# Altium project NC1-1AA.PrjPcb (part 2 of 2)
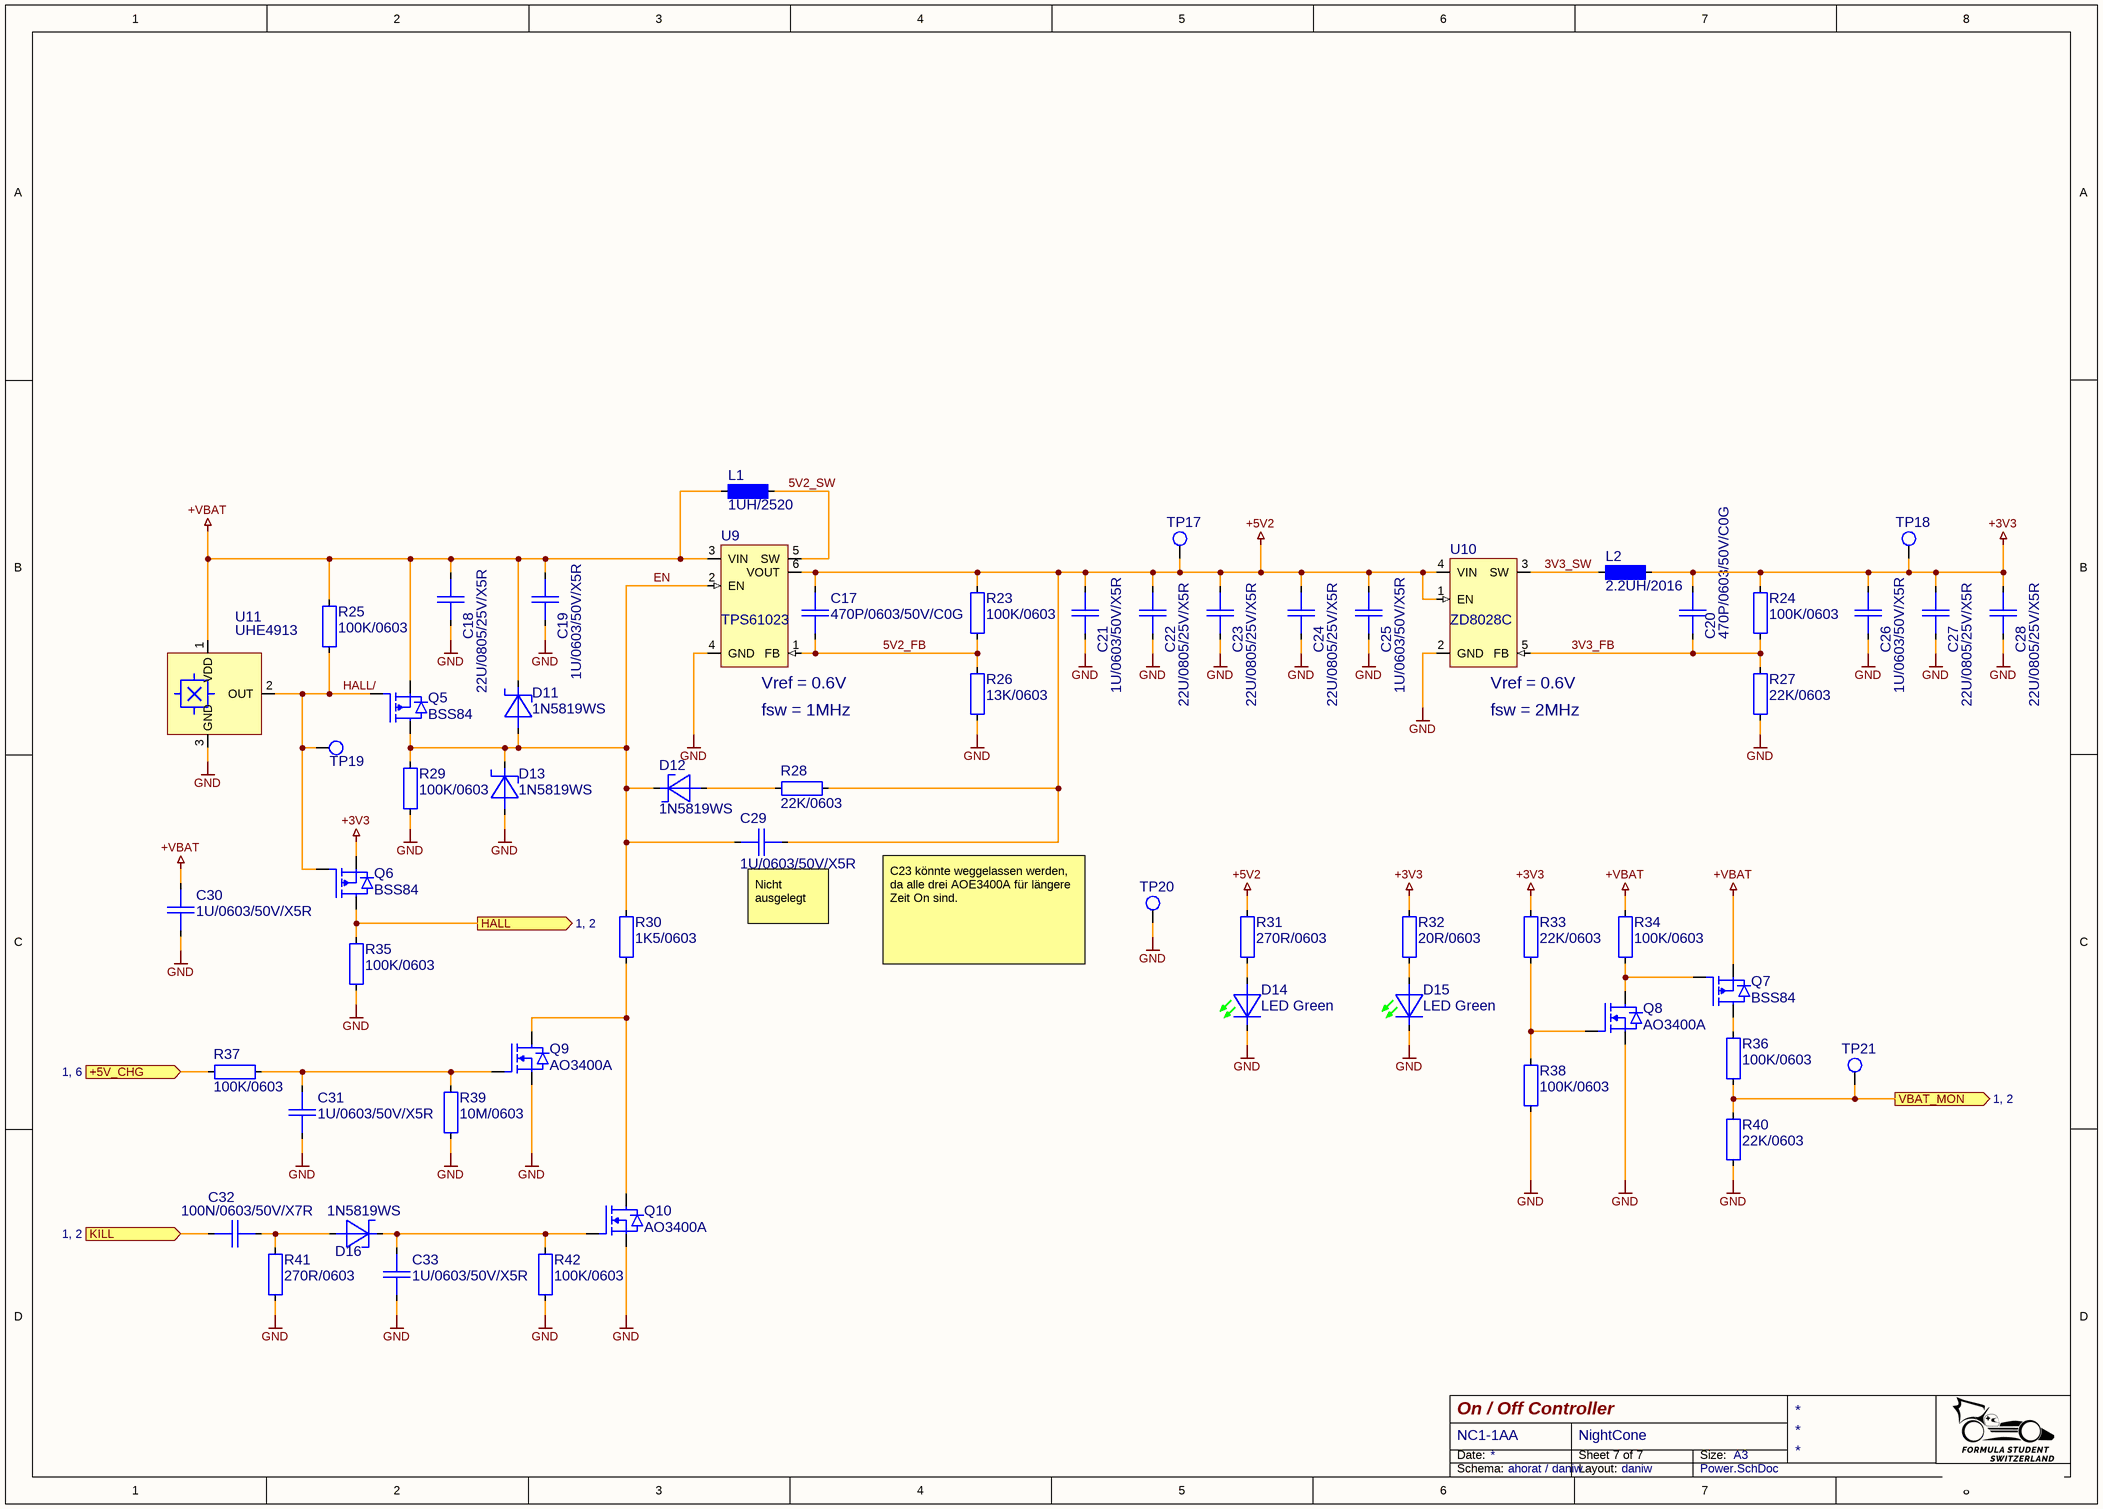
[diagram p7: Power.SchDoc]

## Nets that join several sheets
+3V3: Control (M1.8 M2.8 R1.1 R2.1), Power (10 pins)
+5V2: FailSafe (15 pins), Lights/LED0 (C11_LED0.1 R11_LED0.1 U6_LED0.2), Lights/LED1 (C11_LED1.1 R11_LED1.1 U6_LED1.2), Lights/LED2 (C11_LED2.1 R11_LED2.1 U6_LED2.2), Lights/LED3 (C11_LED3.1 R11_LED3.1 U6_LED3.2), Lights/LED4 (C11_LED4.1 R11_LED4.1 U6_LED4.2), Lights/LED5 (C11_LED5.1 R11_LED5.1 U6_LED5.2), Lights/LED6 (C11_LED6.1 R11_LED6.1 U6_LED6.2), Lights/LED7 (C11_LED7.1 R11_LED7.1 U6_LED7.2), Lights/LED8 (C11_LED8.1 R11_LED8.1 U6_LED8.2), Lights/LED9 (C11_LED9.1 R11_LED9.1 U6_LED9.2), Lights/LED10 (C11_LED10.1 R11_LED10.1 U6_LED10.2), Lights/LED11 (C11_LED11.1 R11_LED11.1 U6_LED11.2), Lights/LED12 (C11_LED12.1 R11_LED12.1 U6_LED12.2), Lights/LED13 (C11_LED13.1 R11_LED13.1 U6_LED13.2), Lights/LED14 (C11_LED14.1 R11_LED14.1 U6_LED14.2), Lights/LED15 (C11_LED15.1 R11_LED15.1 U6_LED15.2), Lights/LED16 (C11_LED16.1 R11_LED16.1 U6_LED16.2), Lights/LED17 (C11_LED17.1 R11_LED17.1 U6_LED17.2), Lights/LED18 (C11_LED18.1 R11_LED18.1 U6_LED18.2), Lights/LED19 (C11_LED19.1 R11_LED19.1 U6_LED19.2), Power (14 pins)
+VBAT: Charger (6 pins), Power (11 pins)
GND: Control (M1.1 M2.15), FailSafe (18 pins), Lights/LED0 (C11_LED0.2 C12_LED0.2 U6_LED0.5 U6_LED0.6), Lights/LED1 (C11_LED1.2 C12_LED1.2 U6_LED1.5), Lights/LED2 (C11_LED2.2 C12_LED2.2 U6_LED2.5), Lights/LED3 (C11_LED3.2 C12_LED3.2 U6_LED3.5), Lights/LED4 (C11_LED4.2 C12_LED4.2 U6_LED4.5), Lights/LED5 (C11_LED5.2 C12_LED5.2 U6_LED5.5), Lights/LED6 (C11_LED6.2 C12_LED6.2 U6_LED6.5), Lights/LED7 (C11_LED7.2 C12_LED7.2 U6_LED7.5), Lights/LED8 (C11_LED8.2 C12_LED8.2 U6_LED8.5), Lights/LED9 (C11_LED9.2 C12_LED9.2 U6_LED9.5), Lights/LED10 (C11_LED10.2 C12_LED10.2 U6_LED10.5), Lights/LED11 (C11_LED11.2 C12_LED11.2 U6_LED11.5), Lights/LED12 (C11_LED12.2 C12_LED12.2 U6_LED12.5), Lights/LED13 (C11_LED13.2 C12_LED13.2 U6_LED13.5), Lights/LED14 (C11_LED14.2 C12_LED14.2 U6_LED14.5), Lights/LED15 (C11_LED15.2 C12_LED15.2 U6_LED15.5), Lights/LED16 (C11_LED16.2 C12_LED16.2 U6_LED16.5), Lights/LED17 (C11_LED17.2 C12_LED17.2 U6_LED17.5), Lights/LED18 (C11_LED18.2 C12_LED18.2 U6_LED18.5), Lights/LED19 (C11_LED19.2 C12_LED19.2 U6_LED19.5), Charger (14 pins), Power (32 pins)
+5V_CHG: Charger (10 pins), Power (R37.1)
B1: Lights/LED0 (R12_LED0.2 R13_LED0.2), Lights/LED1 (U6_LED1.6)
B2: Lights/LED1 (R12_LED1.2 R13_LED1.2), Lights/LED2 (U6_LED2.6)
B3: Lights/LED2 (R12_LED2.2 R13_LED2.2), Lights/LED3 (U6_LED3.6)
B4: Lights/LED3 (R12_LED3.2 R13_LED3.2), Lights/LED4 (U6_LED4.6)
B5: Lights/LED4 (R12_LED4.2 R13_LED4.2), Lights/LED5 (U6_LED5.6)
B6: Lights/LED5 (R12_LED5.2 R13_LED5.2), Lights/LED6 (U6_LED6.6)
B7: Lights/LED6 (R12_LED6.2 R13_LED6.2), Lights/LED7 (U6_LED7.6)
B8: Lights/LED7 (R12_LED7.2 R13_LED7.2), Lights/LED8 (U6_LED8.6)
B9: Lights/LED8 (R12_LED8.2 R13_LED8.2), Lights/LED9 (U6_LED9.6)
B10: Lights/LED9 (R12_LED9.2 R13_LED9.2), Lights/LED10 (U6_LED10.6)
B11: Lights/LED10 (R12_LED10.2 R13_LED10.2), Lights/LED11 (U6_LED11.6)
B12: Lights/LED11 (R12_LED11.2 R13_LED11.2), Lights/LED12 (U6_LED12.6)
B13: Lights/LED12 (R12_LED12.2 R13_LED12.2), Lights/LED13 (U6_LED13.6)
B14: Lights/LED13 (R12_LED13.2 R13_LED13.2), Lights/LED14 (U6_LED14.6)
B15: Lights/LED14 (R12_LED14.2 R13_LED14.2), Lights/LED15 (U6_LED15.6)
B16: Lights/LED15 (R12_LED15.2 R13_LED15.2), Lights/LED16 (U6_LED16.6)
B17: Lights/LED16 (R12_LED16.2 R13_LED16.2), Lights/LED17 (U6_LED17.6)
B18: Lights/LED17 (R12_LED17.2 R13_LED17.2), Lights/LED18 (U6_LED18.6)
B19: Lights/LED18 (R12_LED18.2 R13_LED18.2), Lights/LED19 (U6_LED19.6)
B20: Lights (TP2#2.1), Lights/LED19 (R12_LED19.2 R13_LED19.2)
CHG_A: NC1-1-Top (J1.1), Charger (D2.2 D8.1)
CHG_B: NC1-1-Top (J2.1), Charger (D3.2 D9.1)
CHG_C: NC1-1-Top (J3.1), Charger (D4.2 D10.1)
D1: Lights/LED0 (U6_LED0.3), Lights/LED1 (R13_LED1.1 U6_LED1.4)
D2: Lights/LED1 (U6_LED1.3), Lights/LED2 (R13_LED2.1 U6_LED2.4)
D3: Lights/LED2 (U6_LED2.3), Lights/LED3 (R13_LED3.1 U6_LED3.4)
D4: Lights/LED3 (U6_LED3.3), Lights/LED4 (R13_LED4.1 U6_LED4.4)
D5: Lights/LED4 (U6_LED4.3), Lights/LED5 (R13_LED5.1 U6_LED5.4)
D6: Lights/LED5 (U6_LED5.3), Lights/LED6 (R13_LED6.1 U6_LED6.4)
D7: Lights/LED6 (U6_LED6.3), Lights/LED7 (R13_LED7.1 U6_LED7.4)
D8: Lights/LED7 (U6_LED7.3), Lights/LED8 (R13_LED8.1 U6_LED8.4)
D9: Lights/LED8 (U6_LED8.3), Lights/LED9 (R13_LED9.1 U6_LED9.4)
D10: Lights/LED9 (U6_LED9.3), Lights/LED10 (R13_LED10.1 U6_LED10.4)
D11: Lights/LED10 (U6_LED10.3), Lights/LED11 (R13_LED11.1 U6_LED11.4)
D12: Lights/LED11 (U6_LED11.3), Lights/LED12 (R13_LED12.1 U6_LED12.4)
D13: Lights/LED12 (U6_LED12.3), Lights/LED13 (R13_LED13.1 U6_LED13.4)
D14: Lights/LED13 (U6_LED13.3), Lights/LED14 (R13_LED14.1 U6_LED14.4)
D15: Lights/LED14 (U6_LED14.3), Lights/LED15 (R13_LED15.1 U6_LED15.4)
D16: Lights/LED15 (U6_LED15.3), Lights/LED16 (R13_LED16.1 U6_LED16.4)
D17: Lights/LED16 (U6_LED16.3), Lights/LED17 (R13_LED17.1 U6_LED17.4)
D18: Lights/LED17 (U6_LED17.3), Lights/LED18 (R13_LED18.1 U6_LED18.4)
D19: Lights/LED18 (U6_LED18.3), Lights/LED19 (R13_LED19.1 U6_LED19.4)
D20: Lights (TP1#2.1), Lights/LED19 (U6_LED19.3)
DATA: Control (M1.3 M2.16 TP2#1.1), FailSafe (Q1.1 R7.2)
DATA_FAILSAFE: FailSafe (R9.2 TP10.1), Lights/LED0 (R13_LED0.1 U6_LED0.4)
HALL: Control (M2.5), Power (Q6.3 R35.1)
KILL: Control (M1.2 M2.7 TP1#1.1), Power (C32.1)
VBAT_MON: Control (M2.2), Power (R36.2 R40.1 TP21.1)

## Assembly variants
WS2813B-B: not fitted C67 M1 Q4 R21 R24 R27 R30 R33 R36 R39 R42 R45 R48 R51 R54 R57 R60 R63 R66 R69 R72 R75 R78; alternate parts U8 -> WS2813B-B, U15 -> WS2813B-B, U16 -> WS2813B-B, U17 -> WS2813B-B, U18 -> WS2813B-B, U19 -> WS2813B-B, U20 -> WS2813B-B, U21 -> WS2813B-B, U22 -> WS2813B-B, U23 -> WS2813B-B, U24 -> WS2813B-B, U25 -> WS2813B-B, U26 -> WS2813B-B, U27 -> WS2813B-B, U9 -> WS2813B-B, U10 -> WS2813B-B, U11 -> WS2813B-B, U12 -> WS2813B-B, U13 -> WS2813B-B, U14 -> WS2813B-B
WS2813B-V5: not fitted C16 C18 C20 C22 C24 C26 C28 C30 C32 C34 C36 C38 C40 C42 C44 C46 C48 C50 C52 C54 C67 M1 Q4 R20 R22 R23 R25 R26 R28 R29 R31 R32 R34 R35 R37 R38 R40 R41 R43 R44 R46 R47 R49 R50 R52 R53 R55 R56 R58 R59 R61 R62 R64 R65 R67 R68 R70 R71 R73 R74 R76 R77 R79; alternate parts R17 -> 910R/0603, R19 -> 1K2/0603, U8 -> WS2813B-V5, U9 -> WS2813B-V5, U16 -> WS2813B-V5, U17 -> WS2813B-V5, U18 -> WS2813B-V5, U19 -> WS2813B-V5, U20 -> WS2813B-V5, U22 -> WS2813B-V5, U23 -> WS2813B-V5, U21 -> WS2813B-V5, U25 -> WS2813B-V5, U26 -> WS2813B-V5, U24 -> WS2813B-V5, U27 -> WS2813B-V5, U10 -> WS2813B-V5, U13 -> WS2813B-V5, U12 -> WS2813B-V5, U14 -> WS2813B-V5, U15 -> WS2813B-V5, U11 -> WS2813B-V5
WS2813C: not fitted C67 M1 Q4 R21 R24 R27 R30 R33 R36 R39 R42 R45 R48 R51 R54 R57 R60 R63 R66 R69 R72 R75 R78; alternate parts U8 -> WS2813C, U15 -> WS2813C, U16 -> WS2813C, U17 -> WS2813C, U18 -> WS2813C, U19 -> WS2813C, U20 -> WS2813C, U21 -> WS2813C, U22 -> WS2813C, U23 -> WS2813C, U24 -> WS2813C, U25 -> WS2813C, U26 -> WS2813C, U27 -> WS2813C, U9 -> WS2813C, U10 -> WS2813C, U11 -> WS2813C, U12 -> WS2813C, U13 -> WS2813C, U14 -> WS2813C
WS2813E: not fitted C16 C18 C20 C22 C24 C26 C28 C30 C32 C34 C36 C38 C40 C42 C44 C46 C48 C50 C52 C54 C67 M1 Q4 R20 R21 R23 R24 R26 R27 R29 R30 R32 R33 R35 R36 R38 R39 R41 R42 R44 R45 R47 R48 R50 R51 R53 R54 R56 R57 R59 R60 R62 R63 R65 R66 R68 R69 R71 R72 R74 R75 R77 R78; alternate parts U8 -> WS2813E, U15 -> WS2813E, U16 -> WS2813E, U17 -> WS2813E, U18 -> WS2813E, U19 -> WS2813E, U20 -> WS2813E, U21 -> WS2813E, U22 -> WS2813E, U23 -> WS2813E, U24 -> WS2813E, U25 -> WS2813E, U26 -> WS2813E, U27 -> WS2813E, U9 -> WS2813E, U10 -> WS2813E, U11 -> WS2813E, U12 -> WS2813E, U13 -> WS2813E, U14 -> WS2813E